# Altium schematic sheet 12-TEMPERATURE.SchDoc: TEMPERATURE
size A4; Author: Alexandre Cosneau; CompanyName: Tristar Multicopters; DrawnBy: Alexandre Cosneau; Engineer: Alexandre Cosneau; Organization: Tristar Multicopters; Address1: Genie / GEGI; Address2: 2500 boulevard de l'universite; Address3: J1K2R SHERBROOKE; Address4: QUEBEC, CANADA; DocumentNumber: 5; Revision: 1.0; SheetNumber: 5; SheetTotal: 7
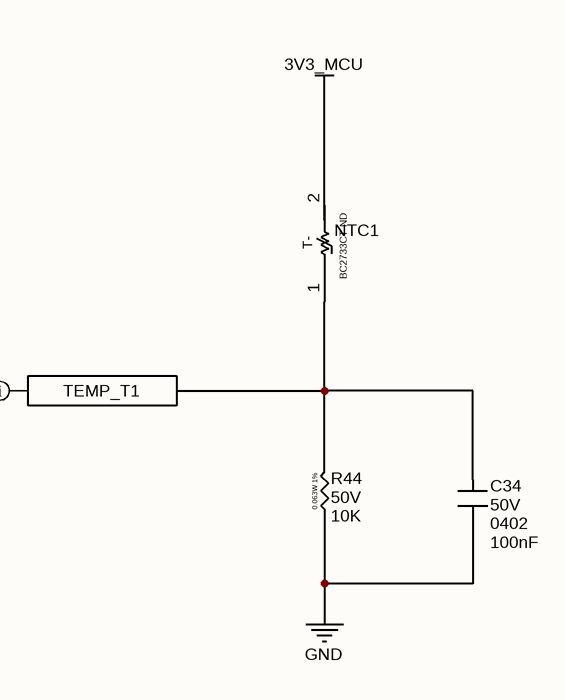
[diagram p0: 12-TEMPERATURE.SchDoc]

## Parts
C34  VDC: 50V  Package: 0402  [C 0402(1005)x0.5]  (hidden comment: 100nF)
NTC1  Supplier Part Number 1: BC2733CT-ND  [R 0805(2012)]  (hidden comment: NTCS0805E3103FLT)
R44  VDC: 50V  [R 0402(1005)-1%]  (hidden comment: 10K)

## Ports
TEMP_T1

## Nets
3V3_MCU: NTC1.2
GND: C34.2 R44.1
TEMP_T1: C34.1 NTC1.1 R44.2 ; port TEMP_T1

## Layout directives
net class ANALOG: TEMP_T1

## Notes on the sheet
- Title:
- Size:
- Date:
- A
- Revision:
- Time:
- Author:
- Sheet
- of
- File:
- (in symbol NTCS0805E3103FLT) T-
- (in symbol RES 0402-1%) 0.063W 1%

## Library data of the parts
C34 = CAP 0402 100nF 50V X7R: SMD-0402 100nF 50V X7R 10%; Part Number: CL05B104KB5NNNC; Manufacturer: Samsung; TYPE: Capacitors; Package-mm: 1005; Mount Type: SMT; Publisher: Hefest; Manufacturer Alternate: *; Part Number Alternate: *; Published: 07.04.2019; Supplier 1: Comet; Supplier 2: *; Supplier 3: *; Supplier Part Number 1: C0402 100nF 50V X7R; Supplier Part Number 2: *; Supplier Part Number 3: *; RoHS: Y; Technology: Ceramic  MLCC; Value 1: *; Value 2: *; TempCo: X7R; Tolerance %: ±10%; VAC: *; ESR Ohm: *; ComponentLink1Description: Datasheet link; ComponentLink1URL: https://store.comet.bg/download-file.php?id=11; Temperature Range: -55°C ~ +125°C; Price: 0.039; Value: 100nF
NTC1 = NTCS0805E3103FLT: THERMISTOR NTC 10KOHM 3430K 0805; Supplier 1: Digi-Key
R44 = RES 0402-1%: SMD 0402 0.063W 1% 50V; Manufacturer: YAGEO; TempCo: ±100ppm/°C; Package-mm: 1005; Value Code: 1001; Power: 0.0625W; Part Number: *; Mount Type: SMT; Publisher: Hefest; Manufacturer Alternate: *; Published: 07.04.2019; Supplier 1: Comet; Supplier 2: *; Supplier 3: *; Supplier Part Number 1: R0402 1.0K 1% YAG/ASJ; Supplier Part Number 2: *; Supplier Part Number 3: *; RoHS: Y; Technology: Thick film; Value 2: *; Package: 0402; Tolerance %: ±1%; ComponentLink1Description: Datasheet link; ComponentLink1URL: https://store.comet.bg/download-file.php?id=1224; Temperature Range: -55°C ~ +155°C; Price: 0.015; Part Number Alternate: *; TYPE: Resistor; Value 1: *; Value: 10K